# Altium schematic sheet STM32EVALBOARD.SchDoc
size A4; SheetNumber: 1; SheetTotal: 3
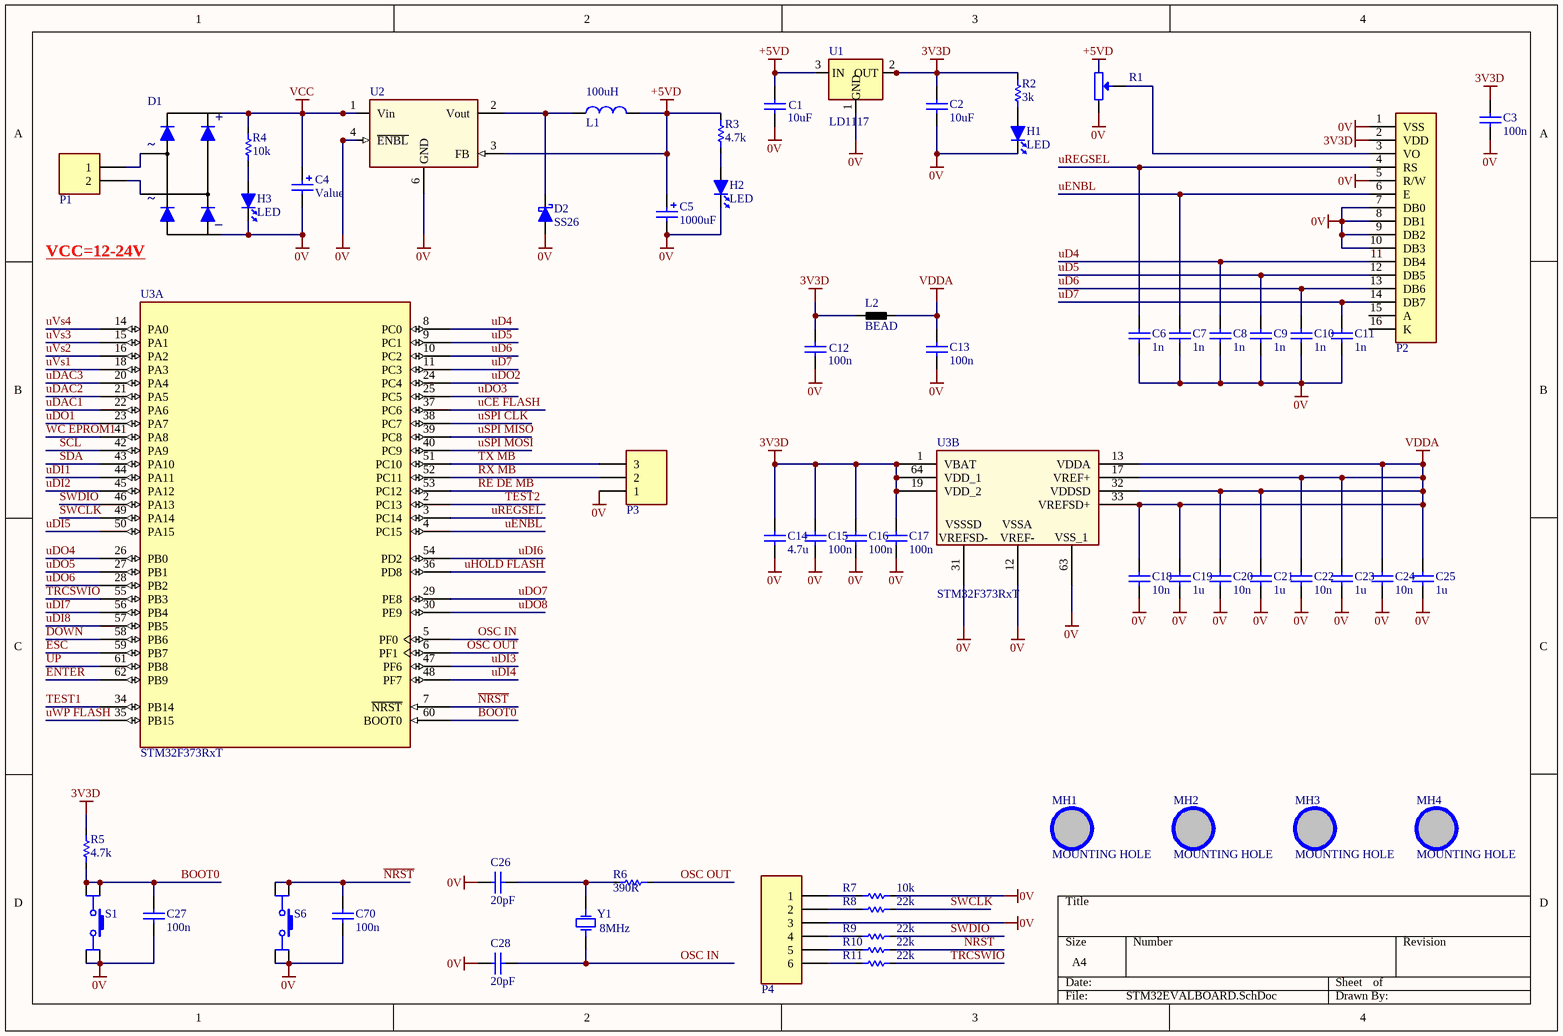
[diagram p0: STM32EVALBOARD.SchDoc]

## Parts
C1  10uF  [CC3216-1206L]
C2  10uF  [CC3216-1206L]
C3  100n  [CC3216-1206L]
C4  Value  [CAP AL-EL H12MM D8MM P3.5MM]
C5  1000uF  [CAP AL-EL H12MM D8MM P3.5MM]
C6  1n  [CC3216-1206L]
C7  1n  [CC3216-1206L]
C8  1n  [CC3216-1206L]
C9  1n  [CC3216-1206L]
C10  1n  [CC3216-1206L]
C11  1n  [CC3216-1206L]
C12  100n  [CC3216-1206L]
C13  100n  [CC3216-1206L]
C14  4.7u  [CC3216-1206L]
C15  100n  [CC3216-1206L]
C16  100n  [CC3216-1206L]
C17  100n  [CC3216-1206L]
C18  10n  [CC3216-1206L]
C19  1u  [CC3216-1206L]
C20  10n  [CC3216-1206L]
C21  1u  [CC3216-1206L]
C22  10n  [CC3216-1206L]
C23  1u  [CC3216-1206L]
C24  10n  [CC3216-1206L]
C25  1u  [CC3216-1206L]
C26  20pF  [CC3216-1206L]
C27  100n  [CC3216-1206L]
C28  20pF  [CC3216-1206L]
C70  100n  [CC3216-1206L]
D1  Single Phase Bridge Diode  [B10S_R2]  (value not drawn)
D2  SS26  [SMB]
H1  LED  [LED1206]
H2  LED  [LED1206]
H3  LED  [LED1206]
L1  100uH  [FPI1005]
L2  BEAD  [CL3216-1206L]
MH1  MOUNTING HOLE  [MOUNTING HOLE ROUND NONPLATED 3MM PLASTIC]  (no BOM)
MH2  MOUNTING HOLE  [MOUNTING HOLE ROUND NONPLATED 3MM PLASTIC]  (no BOM)
MH3  MOUNTING HOLE  [MOUNTING HOLE ROUND NONPLATED 3MM PLASTIC]  (no BOM)
MH4  MOUNTING HOLE  [MOUNTING HOLE ROUND NONPLATED 3MM PLASTIC]  (no BOM)
P1  CONNECTOR, 1x2, 2P  [DG128-5.0-02P-14]  (value not drawn)
P2  CONNECTOR LCD 1x16  [LCD1602]  (value not drawn)
P3  CONNECTOR, 1x3, 3P  [HDR_MALE_1X3_3P_2.54MM_180]  (value not drawn)
P4  CONNECTOR 1X6-6P  [HDR_MALE_1X6_56_2.54MM_180]  (value not drawn)
R1  Trimpot  [TRIMPOT 3386]  (value not drawn)
R2  3k  [CR3216-1206l]
R3  4.7k  [CR3216-1206l]
R4  10k  [CR3216-1206l]
R5  4.7k  [CR3216-1206l]
R6  390R  [CR3216-1206l]
R7  10k  [CR3216-1206l]
R8  22k  [CR3216-1206l]
R9  22k  [CR3216-1206l]
R10  22k  [CR3216-1206l]
R11  22k  [CR3216-1206l]
S1  SWITCH TACT  [SWITCH TACTILE SMD 6x6 4.3mm]  (value not drawn)
S6  SWITCH TACT  [SWITCH TACTILE SMD 6x6 4.3mm]  (value not drawn)
U1  LD1117  [SOT230P700X180-4N]
U2  IC-2576 V.REG.3A STEP DOWN SOP-8PP  [SOIC127P600X175-8N]  (value not drawn)
U3  STM32F373RxT  [LQFP64]  (parts A,B of 2)
Y1  8MHz  [HC49S SMD]

## Nets
0V: C1.2 C2.2 C3.2 C4.2 C5.2 C6.2 C7.2 C8.2 C9.2 C10.2 C11.2 C12.2 C13.2 C14.2 C15.2 C16.2 C17.2 C18.2 C19.2 C20.2 C21.2 C22.2 C23.2 C24.2 C25.2 C26.1 C27.2 C28.1 C70.2 D1.4(-) D2.1 H1.2(CATHODE) H2.2(CATHODE) H3.2(CATHODE) P2.1(VSS) P2.5(R/W) P2.7(DB0) P2.8(DB1) P2.9(DB2) P2.10(DB3) P3.1 P4.3 R1.3 R7.1 S1.3(B) S1.4(B) S6.3(B) S6.4(B) U1.1(GND) U2.4(~{ENBL}) U2.6(GND) U3.12(VSSA/VREF-) U3.31(VSSSD/VREFSD-) U3.63(VSS_1)
3V3D: C2.1 C3.1 C12.1 C14.1 C15.1 C16.1 C17.1 L2.2 P2.2(VDD) R2.2 R5.1 U1.2(OUT) U1.4(OUT) U3.1(VBAT) U3.19(VDD_2) U3.64(VDD_1)
+5VD: C1.1 C5.1 L1.2 R1.1 R3.2 U1.3(IN) U2.3(FB)
VCC: C4.1 D1.1(+) R4.2 U2.1(Vin)
VDDA: C13.1 C18.1 C19.1 C20.1 C21.1 C22.1 C23.1 C24.1 C25.1 L2.1 U3.13(VDDA) U3.17(VREF+) U3.32(VDDSD) U3.33(VREFSD+)
BOOT0: C27.1 R5.2 S1.1(A) S1.2(A) U3.60(BOOT0)
DOWN: U3.58(PB6)
ENTER: U3.62(PB9)
ESC: U3.59(PB7)
~{NRST}: C70.1 R10.1 S6.1(A) S6.2(A) U3.7(~{NRST})
OSC IN: C28.2 U3.5(PF0) Y1.1(OSC1)
OSC OUT: R6.1 U3.6(PF1)
~{RE} DE MB: U3.53(PC12)
RX MB: P3.2 U3.52(PC11)
SCL: U3.42(PA9)
SDA: U3.43(PA10)
SWCLK: R8.1 U3.49(PA14)
SWDIO: R9.1 U3.46(PA13)
TEST1: U3.34(PB14)
TEST2: U3.2(PC13)
TRCSWIO: R11.1 U3.55(PB3)
TX MB: P3.3 U3.51(PC10)
uCE FLASH: U3.37(PC6)
uD4: C8.1 P2.11(DB4) U3.8(PC0)
uD5: C9.1 P2.12(DB5) U3.9(PC1)
uD6: C10.1 P2.13(DB6) U3.10(PC2)
uD7: C11.1 P2.14(DB7) U3.11(PC3)
uDAC1: U3.22(PA6)
uDAC2: U3.21(PA5)
uDAC3: U3.20(PA4)
uDI1: U3.44(PA11)
uDI2: U3.45(PA12)
uDI3: U3.47(PF6)
uDI4: U3.48(PF7)
uDI5: U3.50(PA15)
uDI6: U3.54(PD2)
uDI7: U3.56(PB4)
uDI8: U3.57(PB5)
uDO1: U3.23(PA7)
uDO2: U3.24(PC4)
uDO3: U3.25(PC5)
uDO4: U3.26(PB0)
uDO5: U3.27(PB1)
uDO6: U3.28(PB2)
uDO7: U3.29(PE8)
uDO8: U3.30(PE9)
uENBL: C7.1 P2.6(E) U3.4(PC15)
uHOLD FLASH: U3.36(PD8)
UP: U3.61(PB8)
uREGSEL: C6.1 P2.4(RS) U3.3(PC14)
uSPI CLK: U3.38(PC7)
uSPI MISO: U3.39(PC8)
uSPI MOSI: U3.40(PC9)
uVs1: U3.18(PA3)
uVs2: U3.16(PA2)
uVs3: U3.15(PA1)
uVs4: U3.14(PA0)
uWP FLASH: U3.35(PB15)
~{WC} EPROM1: U3.41(PA8)
NetC26_2: C26.2 R6.2 Y1.2(OSC2)
NetD1_2: D1.2 P1.1
NetD1_3: D1.3 P1.2
NetD2_2: D2.2 L1.1 U2.2(Vout)
NetH1_1: H1.1(ANODE) R2.1
NetH2_1: H2.1(ANODE) R3.1
NetH3_1: H3.1(ANODE) R4.1
NetP2_3: P2.3(VO) R1.2
NetP4_1: P4.1 R7.2
NetP4_2: P4.2 R8.2
NetP4_4: P4.4 R9.2
NetP4_5: P4.5 R10.2
NetP4_6: P4.6 R11.2

Not connected (* = marked no-connect by the designer): P2 15(A) 16(K); U2 5(NC) 7(NC) 8(NC)

## Notes on the sheet
- (near D1) VCC=12-24V
- (in symbol DIODE DRIDGE) _
- (in symbol STM32F373RxT, part B) VSSSD / VREFSD-; VSSA / VREF-

## Library data of the parts
C1-C3 C6-C28 C70 = CAPACITOR NON-POL: Capacitor; Stock Code: *; Component Type: Capacitor
C4 C5 = CAPACITOR POL: Capacitor; Stock Code: *; Component Type: Capacitor
D1 = DIODE DRIDGE: Component Type: Diode; Stock Code: *
D2 = DIODE SCHOTTKY: SINGLE SCHOTTKY DIODE / Check the suitability of the case with the pin number; Stock Code: *; Component Type: Diode
L1 = INDUCTOR: Stock Code: *; Component Type: Inductor
L2 = BEAD: FERRITE BEAD; Stock Code: *; Component Type: Inductor
P2 = CONNECTOR LCD 1x16: LCD CONNECTOR 1x16; Component Type: Connector
R2-R11 = RESISTOR: Component Type: Resistor
S1 S6 = SWITCH TACT: TACT SWITCH; Stock Code: *; Component Type: Switch
U1 = LD1117: Linear Voltage Regulators; Component Type: IC; Stock Code: *
U2 = LM2576DP: 3A, 52kHz, Step-Down Switching Regulator
Y1 = XTAL: Stock Code: *; Component Type: XTAL
H1-H3 = LED: Stock Code: *; Component Type: Diode
P1 = CONNECTOR, 1x2, 2P: Stock Code: *; Component Type: Connector
P3 = CONNECTOR, 1x3, 3P: Component Type: Connector
P4 = CONNECTOR 1X6-6P: Stock Code: *; Component Type: Connector
R1 = Trimpot: Stock Code: *; Component Type: Resistor